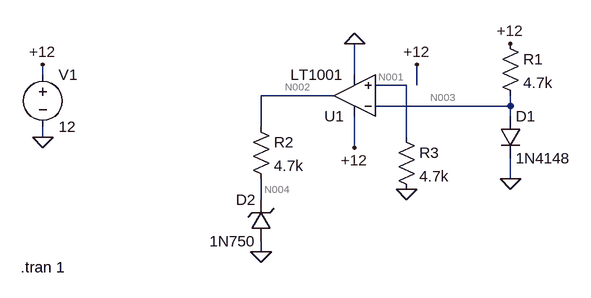
[diagram p0: schematic Draft3.asc]
Draft3.asc, the LTspice schematic file:
Version 4
SHEET 1 880 680
WIRE -448 48 -448 32
WIRE 32 48 32 0
WIRE 112 64 64 64
WIRE 128 64 128 32
WIRE 0 80 -112 80
WIRE 272 96 272 80
WIRE 272 96 64 96
WIRE 272 112 272 96
WIRE -112 128 -112 80
WIRE -448 144 -448 128
WIRE 112 144 112 64
WIRE 32 160 32 112
WIRE 272 208 272 176
WIRE -112 240 -112 208
WIRE -112 320 -112 304
FLAG 272 208 0
FLAG -448 144 0
FLAG -448 32 +12
FLAG 32 160 +12
FLAG 32 0 0
FLAG 272 0 +12
FLAG 128 32 +12
FLAG -112 320 0
FLAG 112 224 0
SYMBOL diode 256 112 R0
SYMATTR InstName D1
SYMATTR Value 1N4148
SYMBOL res 256 -16 R0
SYMATTR InstName R1
SYMATTR Value 4.7k
SYMBOL voltage -448 32 R0
WINDOW 123 0 0 Left 0
WINDOW 39 0 0 Left 0
SYMATTR InstName V1
SYMATTR Value 12
SYMBOL zener -96 304 R180
WINDOW 0 24 64 Left 2
WINDOW 3 24 0 Left 2
SYMATTR InstName D2
SYMATTR Value 1N750
SYMBOL res -128 112 R0
SYMATTR InstName R2
SYMATTR Value 4.7k
SYMBOL OpAmps\\LT1001 32 144 R180
SYMATTR InstName U1
SYMBOL res 96 128 R0
SYMATTR InstName R3
SYMATTR Value 4.7k
TEXT -482 344 Left 2 !.tran 1

The netlist it stands for:
* Draft3.asc
D1 N003 0 1N4148
R1 +12 N003 4.7k
V1 +12 0 12
D2 0 N004 1N750
R2 N002 N004 4.7k
XU1 N001 N003 +12 0 N002 LT1001  ; pins In+ In- V+ V- OUT
R3 N001 0 4.7k
.model D D
.lib standard.dio
.tran 1
.lib LTC.lib
.backanno
.end

* Results of the author's LTspice run, read from the files saved beside the schematic
* Operating Point, zero values left out:
*   V(n003) = 625.6 mV
*   V(+12) = 12 V
*   V(n004) = 930.6 mV
*   V(n002) = 931.1 mV
*   V(n001) = 39.74 µV
*   I(D2) = -110.4 nA
*   I(D1) = 2.42 mA
*   I(R3) = 8.456 nA
*   I(R2) = 110.4 nA
*   I(R1) = 2.42 mA
*   I(V1) = -4.672 mA
*   Ix(u1:1) = -8.456 nA
*   Ix(u1:2) = 8.435 nA
*   Ix(u1:3) = 2.252 mA
*   Ix(u1:4) = -2.248 mA
*   Ix(u1:5) = -110.4 nA